# EAGLE design Esquema reloj pov (EAGLE 7.3.0)
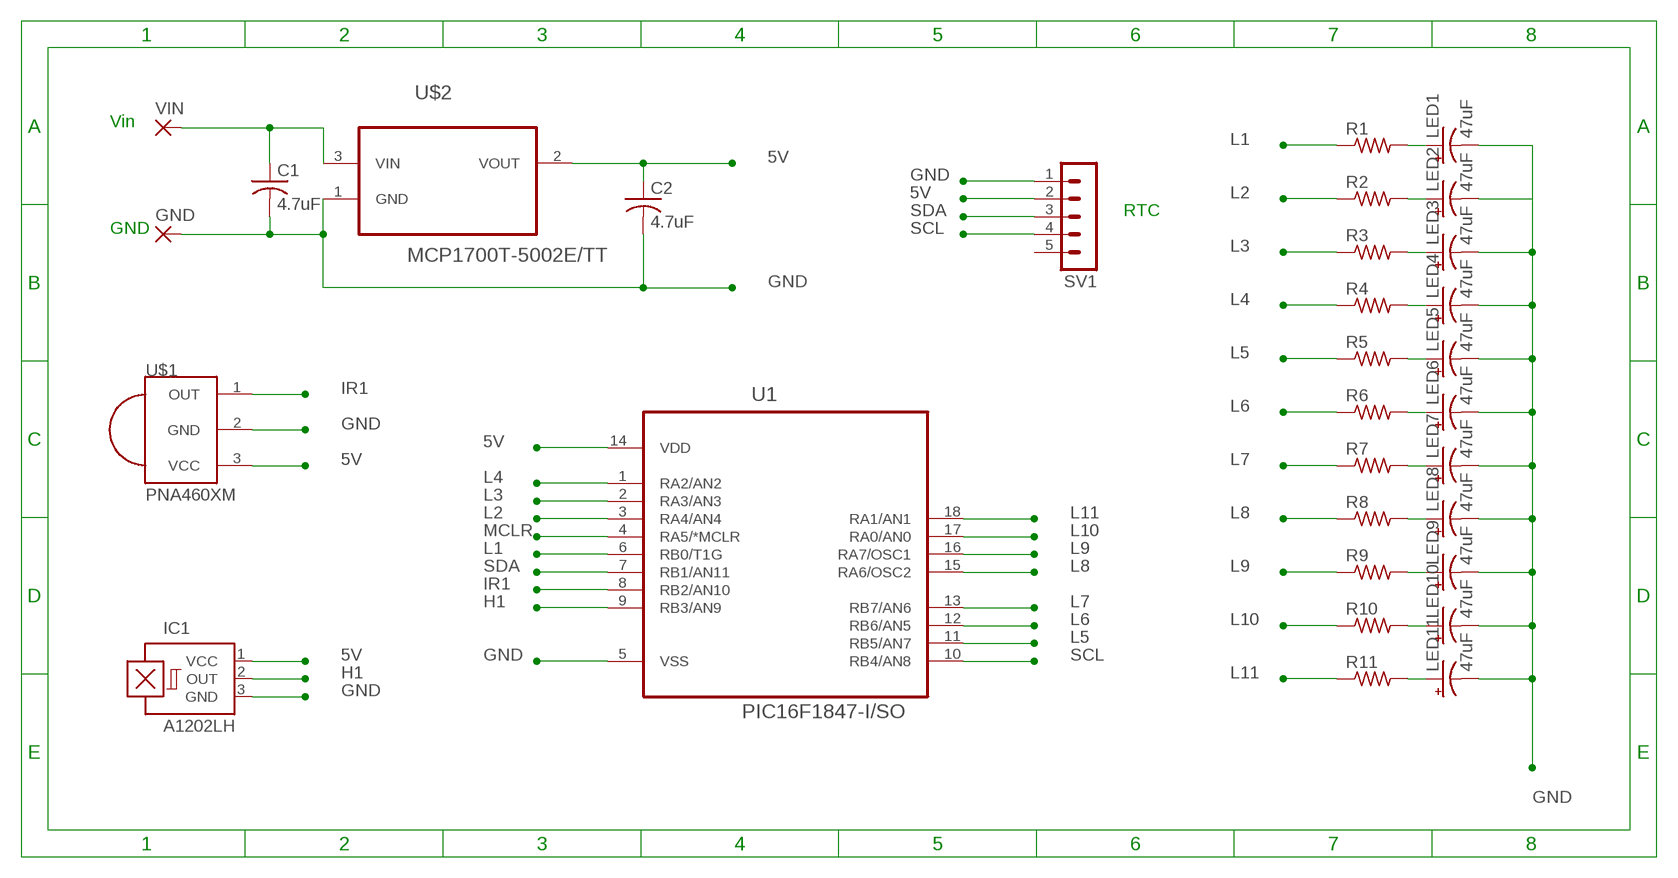
[diagram p0: schematic, sheet 1]

## Parts
C1  4.7uF  C-USC0805K  [C0805K]
C2  4.7uF  C-USC0805K  [C0805K]
GND  2,54/0,8  [2,54/0,8]
IC1  A1202LH  [SOT23-W]
LED1  47uF  47UF-10V-10%(TANT)  [EIA3528]
LED2  47uF  47UF-10V-10%(TANT)  [EIA3528]
LED3  47uF  47UF-10V-10%(TANT)  [EIA3528]
LED4  47uF  47UF-10V-10%(TANT)  [EIA3528]
LED5  47uF  47UF-10V-10%(TANT)  [EIA3528]
LED6  47uF  47UF-10V-10%(TANT)  [EIA3528]
LED7  47uF  47UF-10V-10%(TANT)  [EIA3528]
LED8  47uF  47UF-10V-10%(TANT)  [EIA3528]
LED9  47uF  47UF-10V-10%(TANT)  [EIA3528]
LED10  47uF  47UF-10V-10%(TANT)  [EIA3528]
LED11  47uF  47UF-10V-10%(TANT)  [EIA3528]
R1  R-US_R0805  [R0805]
R2  R-US_R0805  [R0805]
R3  R-US_R0805  [R0805]
R4  R-US_R0805  [R0805]
R5  R-US_R0805  [R0805]
R6  R-US_R0805  [R0805]
R7  R-US_R0805  [R0805]
R8  R-US_R0805  [R0805]
R9  R-US_R0805  [R0805]
R10  R-US_R0805  [R0805]
R11  R-US_R0805  [R0805]
SV1  MA05-1  [MA05-1]
U1  PIC16F1847-I/SO  [SOIC127P1030X265-18N]
U$1  PNA460XM  [PNA460XM]
U$2  MCP1700T-5002E/TT  [SOT95P237X112-3N]
VIN  2,54/0,8  [2,54/0,8]

## Nets
5V: C2.1 IC1.1(VCC) SV1.2 U1.14(VDD) U$1.3(VCC) U$2.2(VOUT)
GND: C1.2 C2.2 GND.1(P) IC1.3(GND) LED1.C(-) LED2.C(-) LED3.C(-) LED4.C(-) LED5.C(-) LED6.C(-) LED7.C(-) LED8.C(-) LED9.C(-) LED10.C(-) LED11.C(-) SV1.1 U1.5(VSS) U$1.2(GND) U$2.1(GND)
H1: IC1.2(OUT) U1.9(RB3/AN9)
IR1: U1.8(RB2/AN10) U$1.1(OUT)
L1: R1.1 U1.6(RB0/T1G)
L2: R2.1 U1.3(RA4/AN4)
L3: R3.1 U1.2(RA3/AN3)
L4: R4.1 U1.1(RA2/AN2)
L5: R5.1 U1.11(RB5/AN7)
L6: R6.1 U1.12(RB6/AN5)
L7: R7.1 U1.13(RB7/AN6)
L8: R8.1 U1.15(RA6/OSC2)
L9: R9.1 U1.16(RA7/OSC1)
L10: R10.1 U1.17(RA0/AN0)
L11: R11.1 U1.18(RA1/AN1)
MCLR: U1.4(RA5/*MCLR)
N$1: LED1.A(+) R1.2
N$2: C1.1 U$2.3(VIN) VIN.1(P)
N$4: LED2.A(+) R2.2
N$5: LED3.A(+) R3.2
N$6: LED4.A(+) R4.2
N$7: LED5.A(+) R5.2
N$8: LED6.A(+) R6.2
N$9: LED7.A(+) R7.2
N$10: LED8.A(+) R8.2
N$11: LED9.A(+) R9.2
N$12: LED10.A(+) R10.2
N$13: LED11.A(+) R11.2
SCL: SV1.4 U1.10(RB4/AN8)
SDA: SV1.3 U1.7(RB1/AN11)
Unconnected: SV1.5

## Notes on the sheet
- Vin
- RTC
- GND

## Library data of the parts
C1 C2 = adafruit:C-US: CAPACITOR, American symbol
GND VIN = wirepad:2,54/0,8: THROUGH-HOLE PAD
IC1 = allegro:A12*?: Hall-effect bipolar switch Source: http://www.allegromicro.com/en/Products/Part_Numbers/1202/1202.pdf; OC_FARNELL: unknown; OC_NEWARK: unknown
LED1-LED11 = SparkFun-Capacitors:47UF-10V-10%(TANT): CAP-08310 47uF Tantalum SMT 10V 10% (EIA-3528); PROD_ID: CAP-08310
R1-R11 = adafruit:R-US_: RESISTOR, American symbol
SV1 = con-lstb:MA05-1: PIN HEADER; OC_FARNELL: unknown; OC_NEWARK: unknown
U1 = PIC 16F1847:PIC16F1847-I/SO: IC, 18 Pin Flash Microcontrollers with XLP Technology-SOIC-18; MPN: PIC16F1847-I/SO; OC_FARNELL: 1971870; OC_NEWARK: 23T3107; PACKAGE: SOIC-18; SUPPLIER: Microchip
U$1 = adafruit:PNA460XM: IR 38KHz receiver PNA4602 and related receivers http://www.ladyada.net/library/pcb/eaglelibrary.html
U$2 = MCP1700T:MCP1700T-5002E/TT: Low Quiescent Current LDO; MPN: MCP1700T-5002E/TT; OC_FARNELL: 1296593; OC_NEWARK: 88H9819; PACKAGE: SOT23-3; SUPPLIER: Microchip

## Board
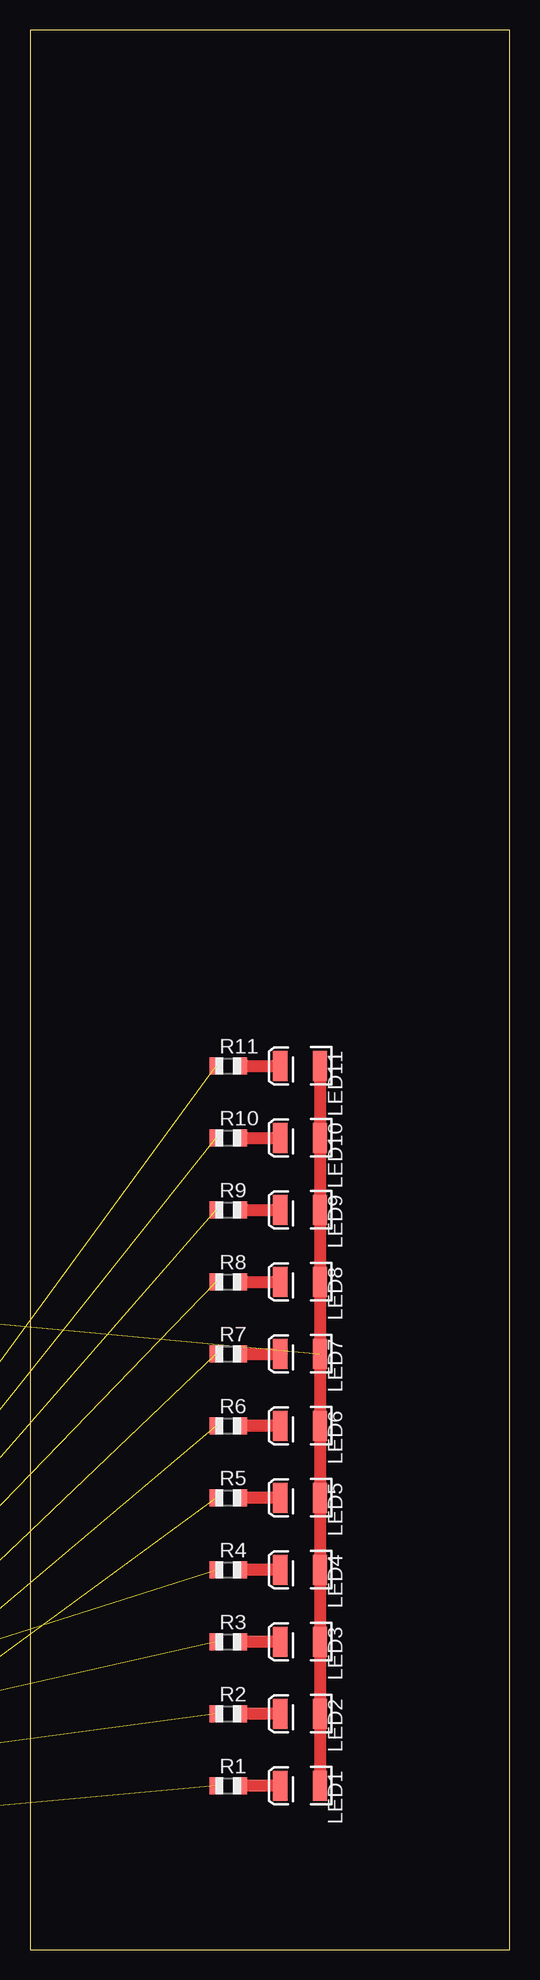
[diagram p1: board, top side]

Size 40 x 160 mm. Coordinates in mm from the lower left corner, seen from the top.
Outline: 0,0 40,0 40,160 0,160 0,0
Copper layers (1*16): Top 0.035mm / dielectric 1.5mm / Bottom 0.035mm
Design rules "default": minimum track width 10mil, minimum drill 24mil, track to track 8mil, track to pad 8mil, pad to pad 8mil, via to via 8mil, smd to smd 8mil, copper to edge 40mil, drill to drill 8mil, minimum pad ring 10mil, minimum via ring 8mil, stop-mask expansion 4mil, vias tented up to drill 0mil, thermal gap 10mil

### Footprints (pad centres in the part's own frame; a part is rotated, then mirrored left to right if it is on the bottom)
C0805K = smd 1.1 x 1.4: 1 -1,0; 2 1,0
2,54/0,8 = drill 0.813 pad 2.54 octagon: 1 0,0
SOT23-W = smd 1.2 x 1.4: 1 -1.1,-1.3; 2 1.1,-1.3 | smd 1.8 x 1.2: 3 0,1.3
EIA3528 = smd 1.2 x 2.5: A 1.65,0; C -1.65,0
R0805 = smd 1.1 x 1.4: 1 -1,0; 2 1,0
MA05-1 = drill 1.016 long: 1 -5.08,0; 2 -2.54,0; 3 0,0; 4 2.54,0; 5 5.08,0
SOIC127P1030X265-18N = smd 1.981 x 0.559: 1 -4.521,5.08; 2 -4.521,3.81; 3 -4.521,2.54; 4 -4.521,1.27; 5 -4.521,0; 6 -4.521,-1.27; 7 -4.521,-2.54; 8 -4.521,-3.81; 9 -4.521,-5.08; 10 4.521,-5.08; 11 4.521,-3.81; 12 4.521,-2.54; 13 4.521,-1.27; 14 4.521,0; 15 4.521,1.27; 16 4.521,2.54; 17 4.521,3.81; 18 4.521,5.08
PNA460XM = drill 1.016 pad 1.93 square: 1 -2.54,0 | drill 1.016 pad 1.93: 2 0,0; 3 2.54,0
SOT95P237X112-3N = smd 0.991 x 1.321: 1 -0.94,-1.016; 2 0.94,-1.016; 3 0,1.016

### Placement (x,y rotation side)
C1  -50.8,46.99 0 top  (outside the outline)
C2  -16.51,53.34 0 top  (outside the outline)
GND  -21.59,52.07 0 top  (outside the outline)
IC1  -49.53,24.13 0 top  (outside the outline)
LED1  22.54,13.65 180 top
LED2  22.54,19.65 180 top
LED3  22.54,25.65 180 top
LED4  22.54,31.65 180 top
LED5  22.54,37.65 180 top
LED6  22.54,43.65 180 top
LED7  22.54,49.65 180 top
LED8  22.54,55.65 180 top
LED9  22.54,61.65 180 top
LED10  22.54,67.65 180 top
LED11  22.54,73.65 180 top
R1  16.54,13.65 0 top
R2  16.54,19.65 0 top
R3  16.54,25.65 0 top
R4  16.54,31.65 0 top
R5  16.54,37.65 0 top
R6  16.54,43.65 0 top
R7  16.54,49.65 0 top
R8  16.54,55.65 0 top
R9  16.54,61.65 0 top
R10  16.54,67.65 0 top
R11  16.54,73.65 0 top
SV1  -20.32,34.29 0 top  (outside the outline)
U1  -31.75,10.16 0 top  (outside the outline)
U$1  -31.75,34.29 0 top  (outside the outline)
U$2  -36.83,25.4 0 top  (outside the outline)
VIN  -26.67,52.07 0 top  (outside the outline)

### Tracks (layer width: path | path; a pad name or v marks a point on that pad's centre or on a via)
5V  (5 unrouted)
GND  (8 unrouted)
  Top 1.016: LED11.C LED10.C LED9.C LED8.C LED7.C LED6.C LED5.C LED4.C LED3.C LED2.C LED1.C
H1  (1 unrouted)
IR1  (1 unrouted)
L1  (1 unrouted)
L2  (1 unrouted)
L3  (1 unrouted)
L4  (1 unrouted)
L5  (1 unrouted)
L6  (1 unrouted)
L7  (1 unrouted)
L8  (1 unrouted)
L9  (1 unrouted)
L10  (1 unrouted)
L11  (1 unrouted)
N$1
  Top 1.016: LED1.A R1.2
N$2  (2 unrouted)
N$4
  Top 1.016: LED2.A R2.2
N$5
  Top 1.016: LED3.A R3.2
N$6
  Top 1.016: LED4.A R4.2
N$7
  Top 1.016: LED5.A R5.2
N$8
  Top 1.016: LED6.A R6.2
N$9
  Top 1.016: R7.2 LED7.A
N$10
  Top 1.016: R8.2 LED8.A
N$11
  Top 1.016: R9.2 LED9.A
N$12
  Top 1.016: R10.2 LED10.A
N$13
  Top 1.016: R11.2 LED11.A
SCL  (1 unrouted)
SDA  (1 unrouted)